# EAGLE design Power Conversion Test Board (EAGLE 9.2.0)
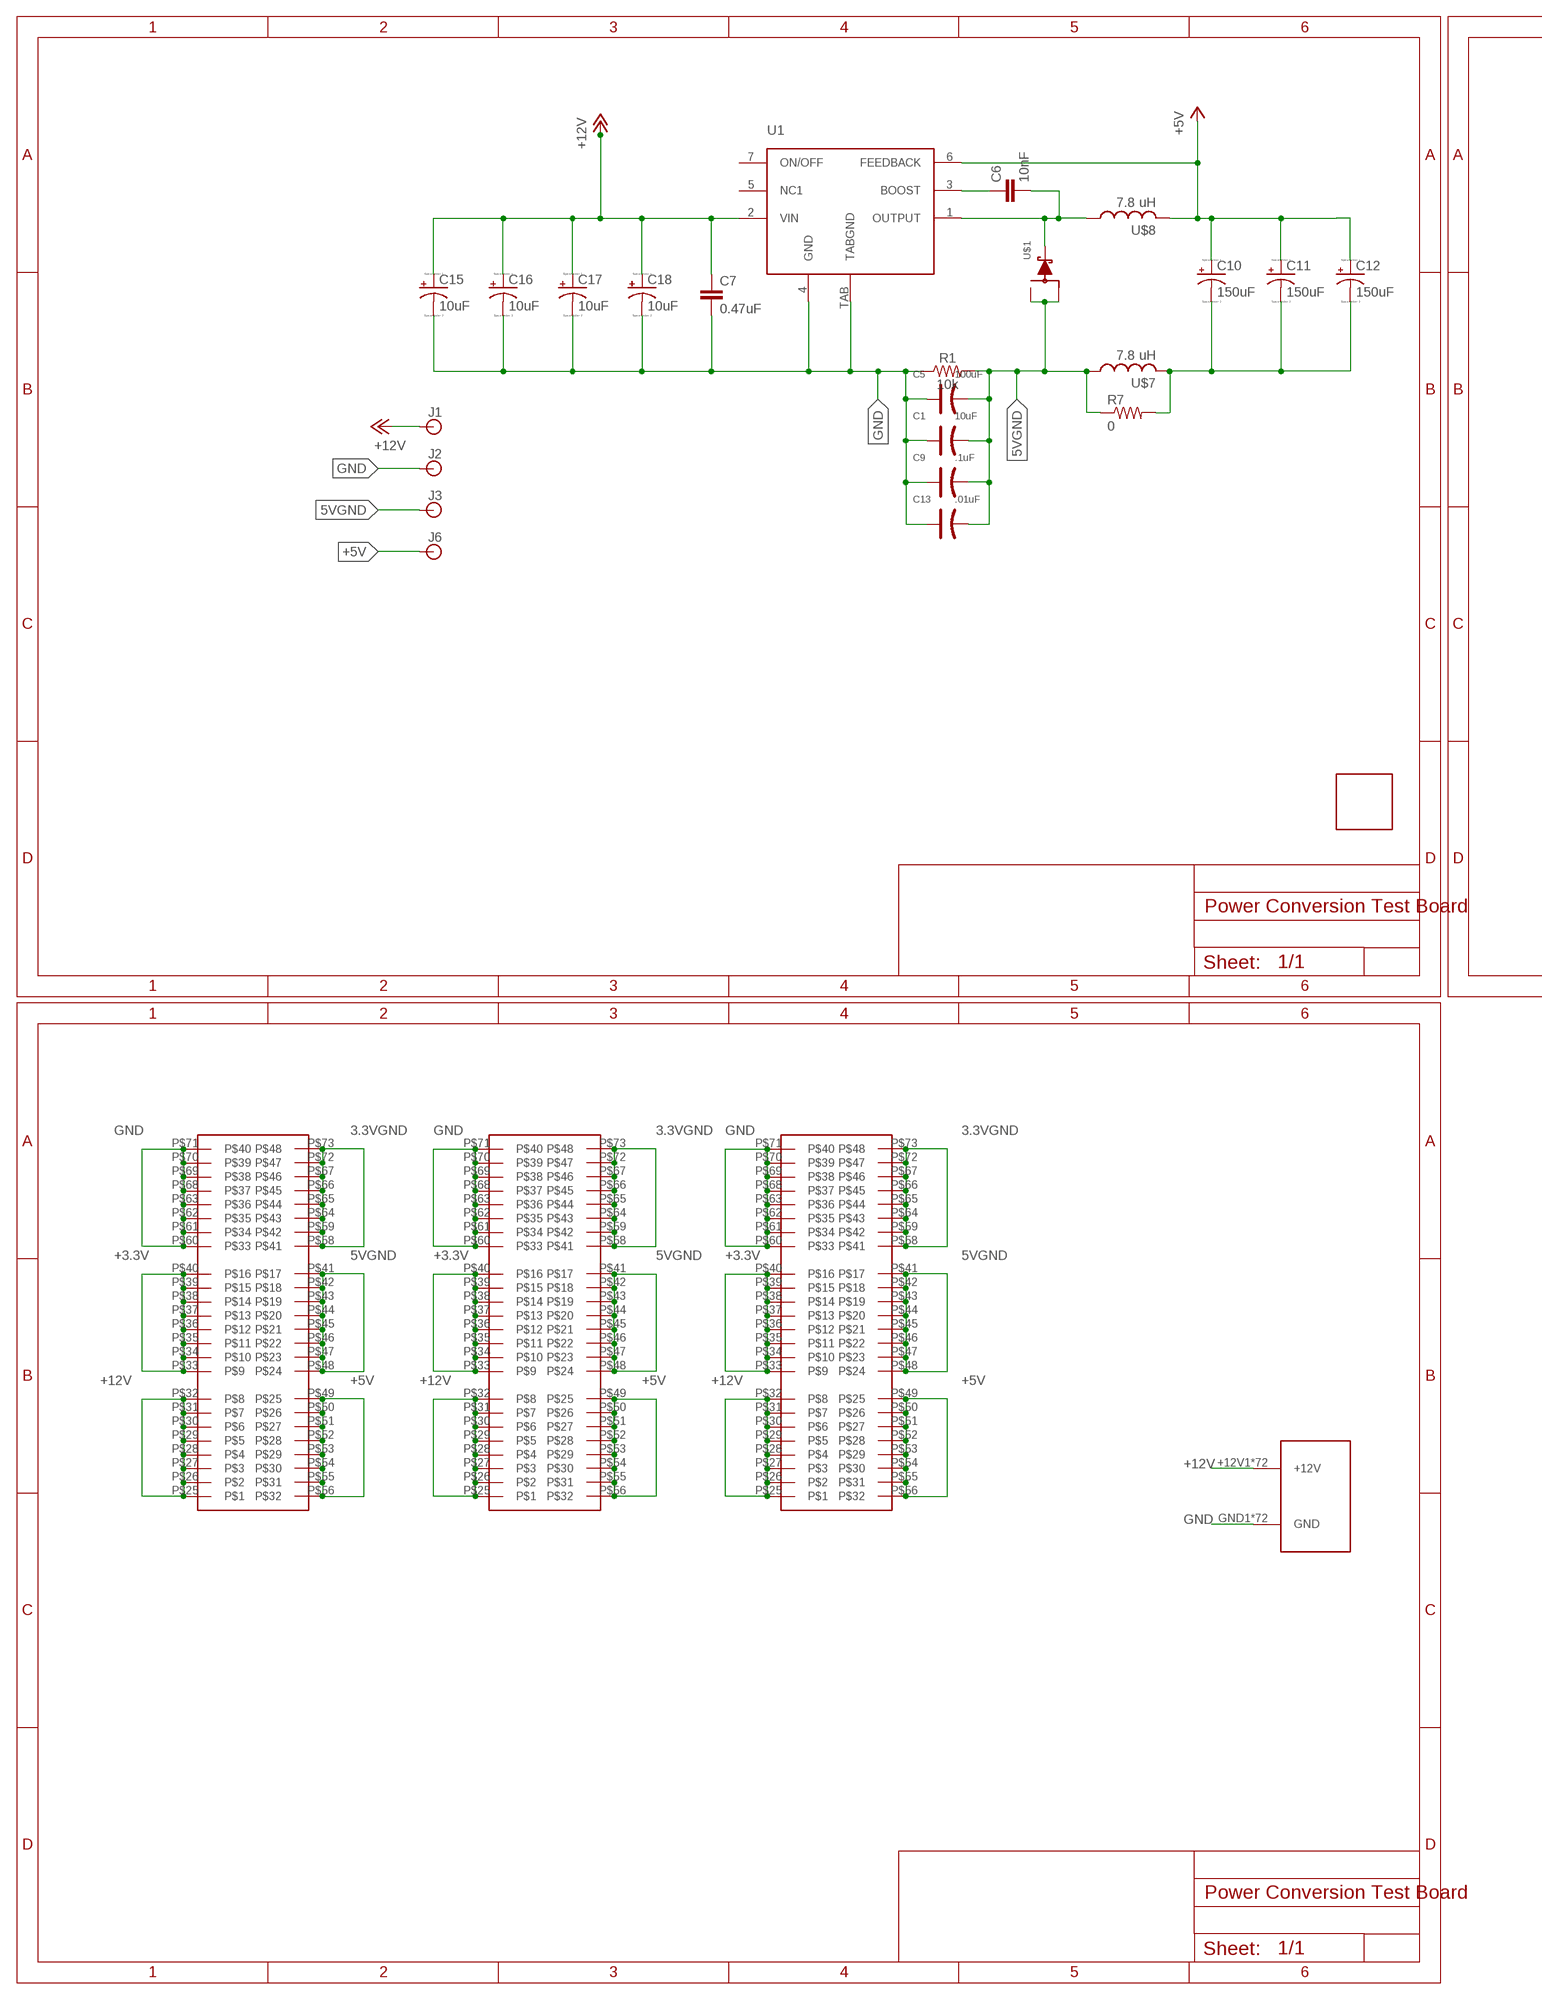
[diagram p0: schematic, sheet 1, part 1 of 2]
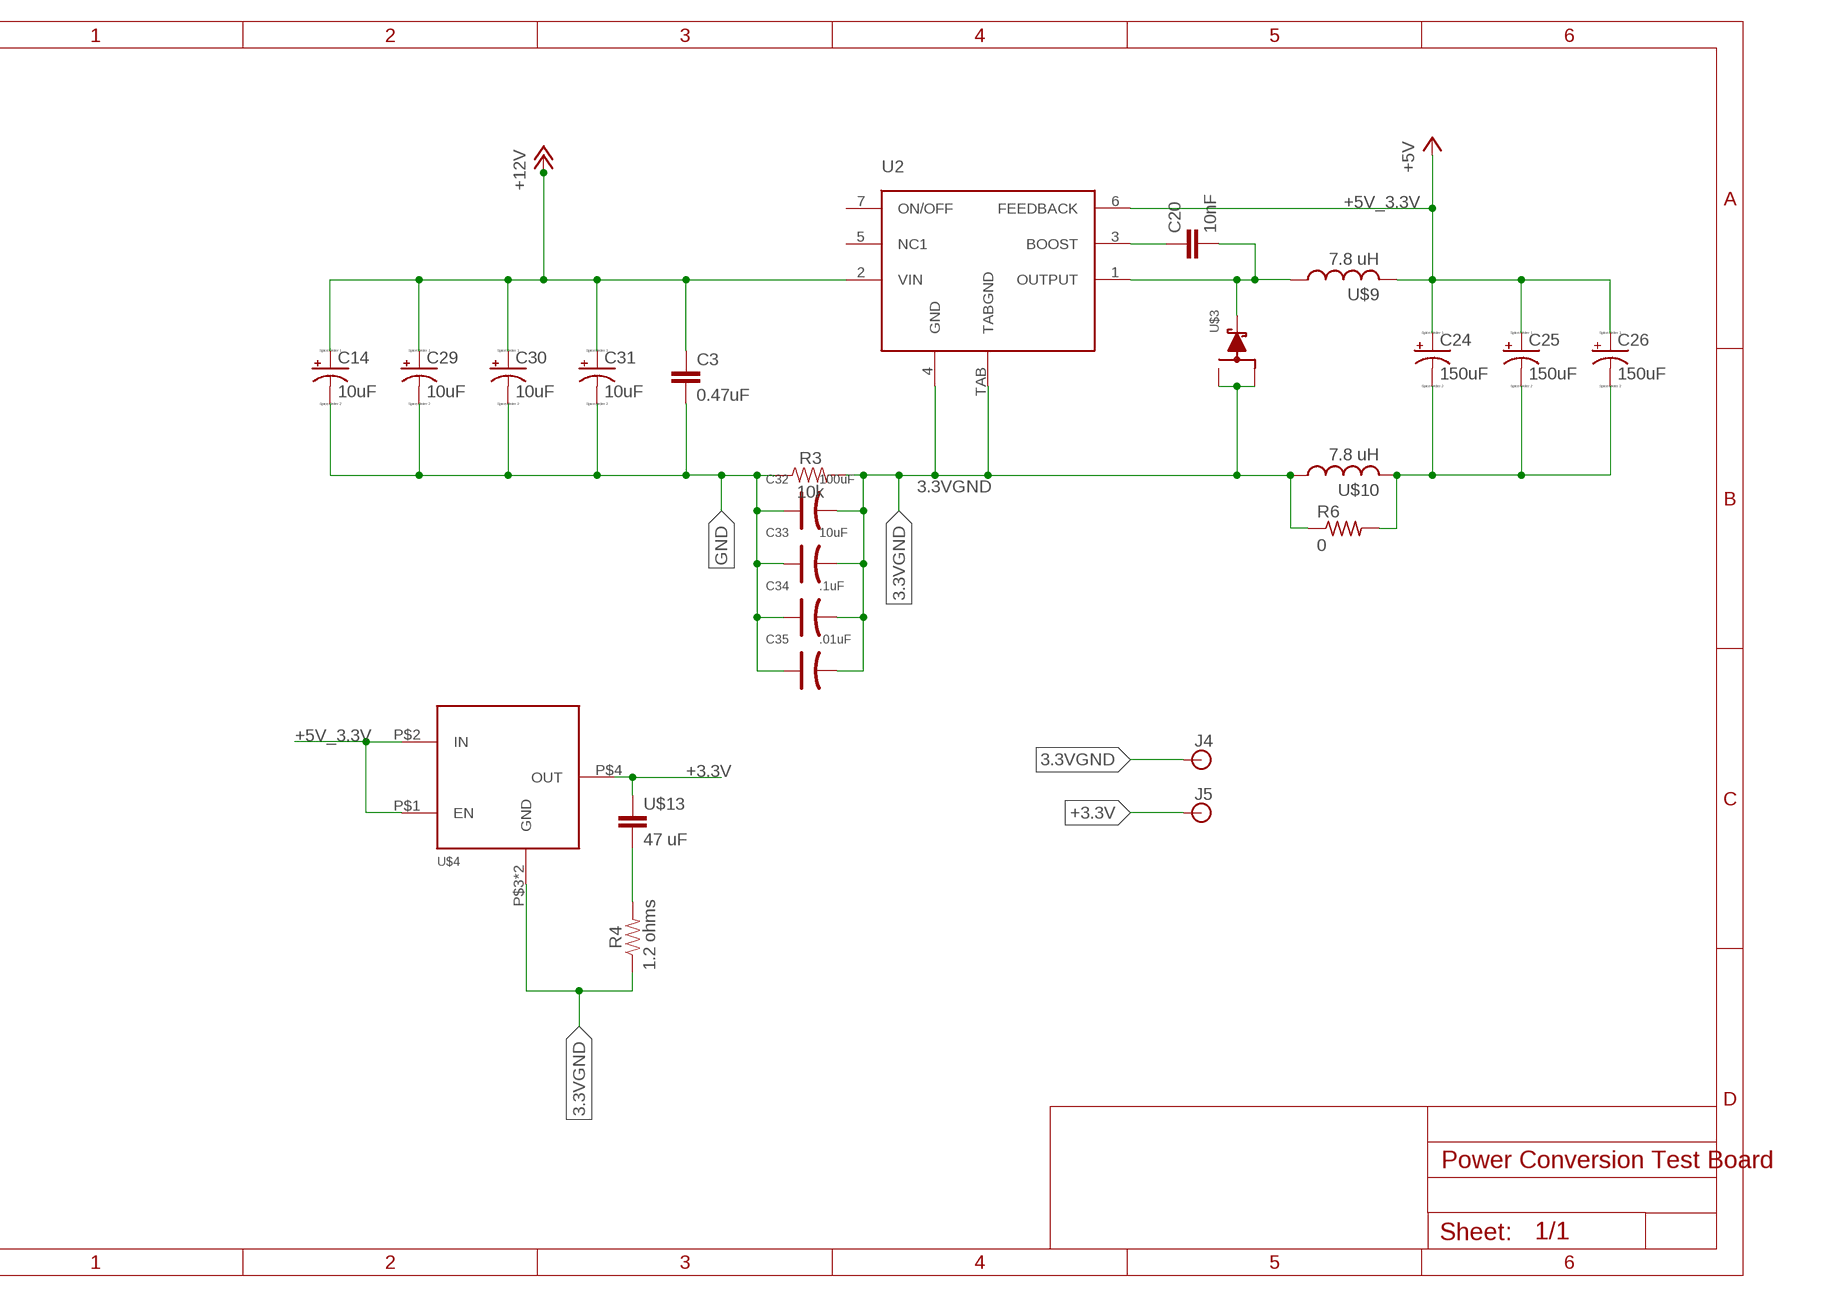
[diagram p1: schematic, sheet 1, part 2 of 2]

## Parts
C1  10uF  TANTALUM-SMD-10UF-16V-10%(AVX-A)  [AVX-A]
C3  0.47uF  C-EUC0603  [C0603]
C5  100uF  TANTALUM-SMD-10UF-16V-10%(AVX-A)  [AVX-A]
C6  10nF  10NF-0603-50V-10%  [0603]
C7  0.47uF  C-EUC0603  [C0603]
C9  .1uF  TANTALUM-SMD-10UF-16V-10%(AVX-A)  [AVX-A]
C10  150uF  C-TANTALUM(10UF_150UF)  [CTAN(7.30_4.30MM)]
C11  150uF  C-TANTALUM(10UF_150UF)  [CTAN(7.30_4.30MM)]
C12  150uF  C-TANTALUM(10UF_150UF)  [CTAN(7.30_4.30MM)]
C13  .01uF  TANTALUM-SMD-10UF-16V-10%(AVX-A)  [AVX-A]
C14  10uF  C-TANTALUM(10UF_150UF)  [CTAN(7.30_4.30MM)]
C15  10uF  C-TANTALUM(10UF_150UF)  [CTAN(7.30_4.30MM)]
C16  10uF  C-TANTALUM(10UF_150UF)  [CTAN(7.30_4.30MM)]
C17  10uF  C-TANTALUM(10UF_150UF)  [CTAN(7.30_4.30MM)]
C18  10uF  C-TANTALUM(10UF_150UF)  [CTAN(7.30_4.30MM)]
C20  10nF  10NF-0603-50V-10%  [0603]
C24  150uF  C-TANTALUM(10UF_150UF)  [CTAN(7.30_4.30MM)]
C25  150uF  C-TANTALUM(10UF_150UF)  [CTAN(7.30_4.30MM)]
C26  150uF  C-TANTALUM(10UF_150UF)  [CTAN(7.30_4.30MM)]
C29  10uF  C-TANTALUM(10UF_150UF)  [CTAN(7.30_4.30MM)]
C30  10uF  C-TANTALUM(10UF_150UF)  [CTAN(7.30_4.30MM)]
C31  10uF  C-TANTALUM(10UF_150UF)  [CTAN(7.30_4.30MM)]
C32  100uF  TANTALUM-SMD-10UF-16V-10%(AVX-A)  [AVX-A]
C33  10uF  TANTALUM-SMD-10UF-16V-10%(AVX-A)  [AVX-A]
C34  .1uF  TANTALUM-SMD-10UF-16V-10%(AVX-A)  [AVX-A]
C35  .01uF  TANTALUM-SMD-10UF-16V-10%(AVX-A)  [AVX-A]
J1  BANANA_CONN  [BANANA_CONN]
J2  BANANA_CONN  [BANANA_CONN]
J3  BANANA_CONN  [BANANA_CONN]
J4  BANANA_CONN  [BANANA_CONN]
J5  BANANA_CONN  [BANANA_CONN]
J6  BANANA_CONN  [BANANA_CONN]
R1  10k  10KOHM-0603-1/10W-1%  [0603]
R3  10k  10KOHM-0603-1/10W-1%  [0603]
R4  1.2 ohms  RESISTOR0603  [0603]
R6  0  R-US_R1206  [R1206]
R7  0  R-US_R1206  [R1206]
U1  LM2678  [LM2678]
U2  LM2678  [LM2678]
U$1  SWITCHMODE_SCHOTTKY  [DPAK-3]
U$2  PDB_PCB_CONNEC  [PDB_PCB_2]
U$3  SWITCHMODE_SCHOTTKY  [DPAK-3]
U$4  TO-263  [TO-263]
U$5  BOARDPCB  [PCB]
U$6  ET60S  [ET60S]
U$7  7.8 uH  HCMA1305  [HCMA1305]
U$8  7.8 uH  HCMA1305  [HCMA1305]
U$9  7.8 uH  HCMA1305  [HCMA1305]
U$10  7.8 uH  HCMA1305  [HCMA1305]
U$11  ET60S  [ET60S]
U$12  ET60S  [ET60S]
U$13  47 uF  CAPACITOR_0603_N  [RESC0603_N]

## Nets
3.3VGND: C32.- C33.- C34.- C35.- J4.P$1 R3.2 R4.1 R6.1 U2.4(GND) U2.TAB(TABGND) U$3.P$1 U$3.P$3 U$4.P$3(GND) U$4.P$6(GND) U$6.P$58 U$6.P$59 U$6.P$64 U$6.P$65 U$6.P$66 U$6.P$67 U$6.P$72 U$6.P$73 U$10.P$1 U$11.P$58 U$11.P$59 U$11.P$64 U$11.P$65 U$11.P$66 U$11.P$67 U$11.P$72 U$11.P$73 U$12.P$58 U$12.P$59 U$12.P$64 U$12.P$65 U$12.P$66 U$12.P$67 U$12.P$72 U$12.P$73
5VGND: C1.- C5.- C9.- C13.- J3.P$1 R1.2 R7.1 U$1.P$1 U$1.P$3 U$6.P$41 U$6.P$42 U$6.P$43 U$6.P$44 U$6.P$45 U$6.P$46 U$6.P$47 U$6.P$48 U$7.P$1 U$11.P$41 U$11.P$42 U$11.P$43 U$11.P$44 U$11.P$45 U$11.P$46 U$11.P$47 U$11.P$48 U$12.P$41 U$12.P$42 U$12.P$43 U$12.P$44 U$12.P$45 U$12.P$46 U$12.P$47 U$12.P$48
+3.3V: J5.P$1 U$4.P$4(OUT) U$6.P$33 U$6.P$34 U$6.P$35 U$6.P$36 U$6.P$37 U$6.P$38 U$6.P$39 U$6.P$40 U$11.P$33 U$11.P$34 U$11.P$35 U$11.P$36 U$11.P$37 U$11.P$38 U$11.P$39 U$11.P$40 U$12.P$33 U$12.P$34 U$12.P$35 U$12.P$36 U$12.P$37 U$12.P$38 U$12.P$39 U$12.P$40 U$13.1
+5V: C10.+ C11.+ C12.+ J6.P$1 U1.6(FEEDBACK) U$6.P$49 U$6.P$50 U$6.P$51 U$6.P$52 U$6.P$53 U$6.P$54 U$6.P$55 U$6.P$56 U$8.P$2 U$11.P$49 U$11.P$50 U$11.P$51 U$11.P$52 U$11.P$53 U$11.P$54 U$11.P$55 U$11.P$56 U$12.P$49 U$12.P$50 U$12.P$51 U$12.P$52 U$12.P$53 U$12.P$54 U$12.P$55 U$12.P$56
+5V_3.3V: C24.+ C25.+ C26.+ U2.6(FEEDBACK) U$4.P$1(EN) U$4.P$2(IN) U$9.P$2 ; supply symbol labelled +5V
+12V: C3.1 C7.1 C14.+ C15.+ C16.+ C17.+ C18.+ C29.+ C30.+ C31.+ J1.P$1 U1.2(VIN) U2.2(VIN) U$2.+12V1(+12V) U$2.+12V2(+12V) U$2.+12V3(+12V) U$2.+12V4(+12V) U$2.+12V5(+12V) U$2.+12V6(+12V) U$2.+12V7(+12V) U$2.+12V8(+12V) U$2.+12V9(+12V) U$2.+12V10(+12V) U$2.+12V11(+12V) U$2.+12V12(+12V) U$2.+12V13(+12V) U$2.+12V14(+12V) U$2.+12V15(+12V) U$2.+12V16(+12V) U$2.+12V17(+12V) U$2.+12V18(+12V) U$2.+12V19(+12V) U$2.+12V20(+12V) U$2.+12V21(+12V) U$2.+12V22(+12V) U$2.+12V23(+12V) U$2.+12V24(+12V) U$2.+12V25(+12V) U$2.+12V26(+12V) U$2.+12V27(+12V) U$2.+12V28(+12V) U$2.+12V29(+12V) U$2.+12V30(+12V) U$2.+12V31(+12V) U$2.+12V32(+12V) U$2.+12V33(+12V) U$2.+12V34(+12V) U$2.+12V35(+12V) U$2.+12V36(+12V) U$2.+12V37(+12V) U$2.+12V38(+12V) U$2.+12V39(+12V) U$2.+12V40(+12V) U$2.+12V41(+12V) U$2.+12V42(+12V) U$2.+12V43(+12V) U$2.+12V44(+12V) U$2.+12V45(+12V) U$2.+12V46(+12V) U$2.+12V47(+12V) U$2.+12V48(+12V) U$2.+12V49(+12V) U$2.+12V50(+12V) U$2.+12V51(+12V) U$2.+12V52(+12V) U$2.+12V53(+12V) U$2.+12V54(+12V) U$2.+12V55(+12V) U$2.+12V56(+12V) U$2.+12V57(+12V) U$2.+12V58(+12V) U$2.+12V59(+12V) U$2.+12V60(+12V) U$2.+12V61(+12V) U$2.+12V62(+12V) U$2.+12V63(+12V) U$2.+12V64(+12V) U$2.+12V65(+12V) U$2.+12V66(+12V) U$2.+12V67(+12V) U$2.+12V68(+12V) U$2.+12V69(+12V) U$2.+12V70(+12V) U$2.+12V71(+12V) U$2.+12V72(+12V) U$6.P$25 U$6.P$26 U$6.P$27 U$6.P$28 U$6.P$29 U$6.P$30 U$6.P$31 U$6.P$32 U$11.P$25 U$11.P$26 U$11.P$27 U$11.P$28 U$11.P$29 U$11.P$30 U$11.P$31 U$11.P$32 U$12.P$25 U$12.P$26 U$12.P$27 U$12.P$28 U$12.P$29 U$12.P$30 U$12.P$31 U$12.P$32
GND: C1.+ C3.2 C5.+ C7.2 C9.+ C13.+ C14.- C15.- C16.- C17.- C18.- C29.- C30.- C31.- C32.+ C33.+ C34.+ C35.+ J2.P$1 R1.1 R3.1 U1.4(GND) U1.TAB(TABGND) U$2.GND1(GND) U$2.GND2(GND) U$2.GND3(GND) U$2.GND4(GND) U$2.GND5(GND) U$2.GND6(GND) U$2.GND7(GND) U$2.GND8(GND) U$2.GND9(GND) U$2.GND10(GND) U$2.GND11(GND) U$2.GND12(GND) U$2.GND13(GND) U$2.GND14(GND) U$2.GND15(GND) U$2.GND16(GND) U$2.GND17(GND) U$2.GND18(GND) U$2.GND19(GND) U$2.GND20(GND) U$2.GND21(GND) U$2.GND22(GND) U$2.GND23(GND) U$2.GND24(GND) U$2.GND25(GND) U$2.GND26(GND) U$2.GND27(GND) U$2.GND28(GND) U$2.GND29(GND) U$2.GND30(GND) U$2.GND31(GND) U$2.GND32(GND) U$2.GND33(GND) U$2.GND34(GND) U$2.GND35(GND) U$2.GND36(GND) U$2.GND37(GND) U$2.GND38(GND) U$2.GND39(GND) U$2.GND40(GND) U$2.GND41(GND) U$2.GND42(GND) U$2.GND43(GND) U$2.GND44(GND) U$2.GND45(GND) U$2.GND46(GND) U$2.GND47(GND) U$2.GND48(GND) U$2.GND49(GND) U$2.GND50(GND) U$2.GND51(GND) U$2.GND52(GND) U$2.GND53(GND) U$2.GND54(GND) U$2.GND55(GND) U$2.GND56(GND) U$2.GND57(GND) U$2.GND58(GND) U$2.GND59(GND) U$2.GND60(GND) U$2.GND61(GND) U$2.GND62(GND) U$2.GND63(GND) U$2.GND64(GND) U$2.GND65(GND) U$2.GND66(GND) U$2.GND67(GND) U$2.GND68(GND) U$2.GND69(GND) U$2.GND70(GND) U$2.GND71(GND) U$2.GND72(GND) U$6.P$60 U$6.P$61 U$6.P$62 U$6.P$63 U$6.P$68 U$6.P$69 U$6.P$70 U$6.P$71 U$11.P$60 U$11.P$61 U$11.P$62 U$11.P$63 U$11.P$68 U$11.P$69 U$11.P$70 U$11.P$71 U$12.P$60 U$12.P$61 U$12.P$62 U$12.P$63 U$12.P$68 U$12.P$69 U$12.P$70 U$12.P$71
N$1: C6.2 U1.1(OUTPUT) U$1.P$4 U$8.P$1
N$2: C20.1 U2.3(BOOST)
N$3: C6.1 U1.3(BOOST)
N$4: C24.- C25.- C26.- R6.2 U$10.P$2
N$7: C20.2 U2.1(OUTPUT) U$3.P$4 U$9.P$1
N$8: C10.- C11.- C12.- R7.2 U$7.P$2
N$10: R4.2 U$13.2
Unconnected: U1.5(NC1) U1.7(ON/OFF) U2.5(NC1) U2.7(ON/OFF)

## Library data of the parts
C1 C5 C9 C13 C32-C35 = Seeed-Capacitor:TANTALUM-SMD-10UF-16V-10%(AVX-A): 302020002; MPN: TAJA106K016RNJ; VALUE: 10uf
C3 C7 = rcl:C-EU: CAPACITOR, European symbol
C6 C20 = SparkFun-Capacitors:10NF: 0.01uF/10nF/10,000pF ceramic capacitors A capacitor is a passive two-terminal electrical component used to store electrical energy temporarily in an electric field. CAP-09321; PROD_ID: CAP-00867
C10-C12 C14-C18 C24-C26 C29-C31 = PowerComponents:C-TANTALUM(10UF_150UF)
J1-J6 = SparkFun-Connectors:BANANA_CONN: Through-hole Banana Jack Basic PTH connection for banana jack plugs SparkFun Products: Multimeter Kit <https://www.sparkfun.com/products/retired/10956> Banana to Alligator Cable <https://www.sparkfun.com/products/retired/509> Banana to Alligator Coax Cable <https://www.sparkfun.com/products/retired/508> Banana to Banana Cable <https://www.sparkfun.com/products/retired/507> Banana to IC Hook Cables <https://www.sparkfun.com/products/retired/506>
R1 R3 = SparkFun-Resistors:10KOHM: 10kΩ resistor A resistor is a passive two-terminal electrical component that implements electrical resistance as a circuit element. Resistors act to reduce current flow, and, at the same time, act to lower voltage levels within circuits. - Wikipedia; PROD_ID: RES-00824
R4 = SparkFun-Resistors:RESISTOR: Generic Resistor Package
R6 = audio amplifier example:R-US_: RESISTOR, American symbol
R7 = audio amplifier example:R-US_: RESISTOR, American symbol; SPICEPREFIX: R
U1 U2 = PowerComponents:LM2678: LM2678 Buck Converter IC 12V-to-5V
U$1 U$3 = PowerComponents:SWITCHMODE_SCHOTTKY: {Digi-Key Part Number: MBRD835LT4GOSCT-ND} {Voltage - DC Reverse (Vr) (Max): 35V} {Current - Average Rectified (Io): 8A} {Voltage - Forward (Vf) (Max) @ If: 510mV @ 8A} {Speed: Fast Recovery =< 500ns, > 200mA (Io)} {Current - Reverse Leakage @ Vr: 1.4mA @ 35V} {Mounting Type: Surface Mount} {Package / Case: TO-252-3, DPak (2 Leads + Tab), SC-63} {Supplier Device Package: DPAK-3} {Operating Temperature - Junction: -65°C ~ 150°C}
U$2 = PDB_PCB_connectors:PDB_PCB_CONNEC
U$4 = TPS758:TO-263
U$5 = board_outlines:BOARD
U$6 U$11 U$12 = ET60S:ET60S
U$7-U$10 = DiscreteComponents:HCMA1305
U$13 = Nordic_nRF:CAPACITOR: Generic chip capacitor

## Board
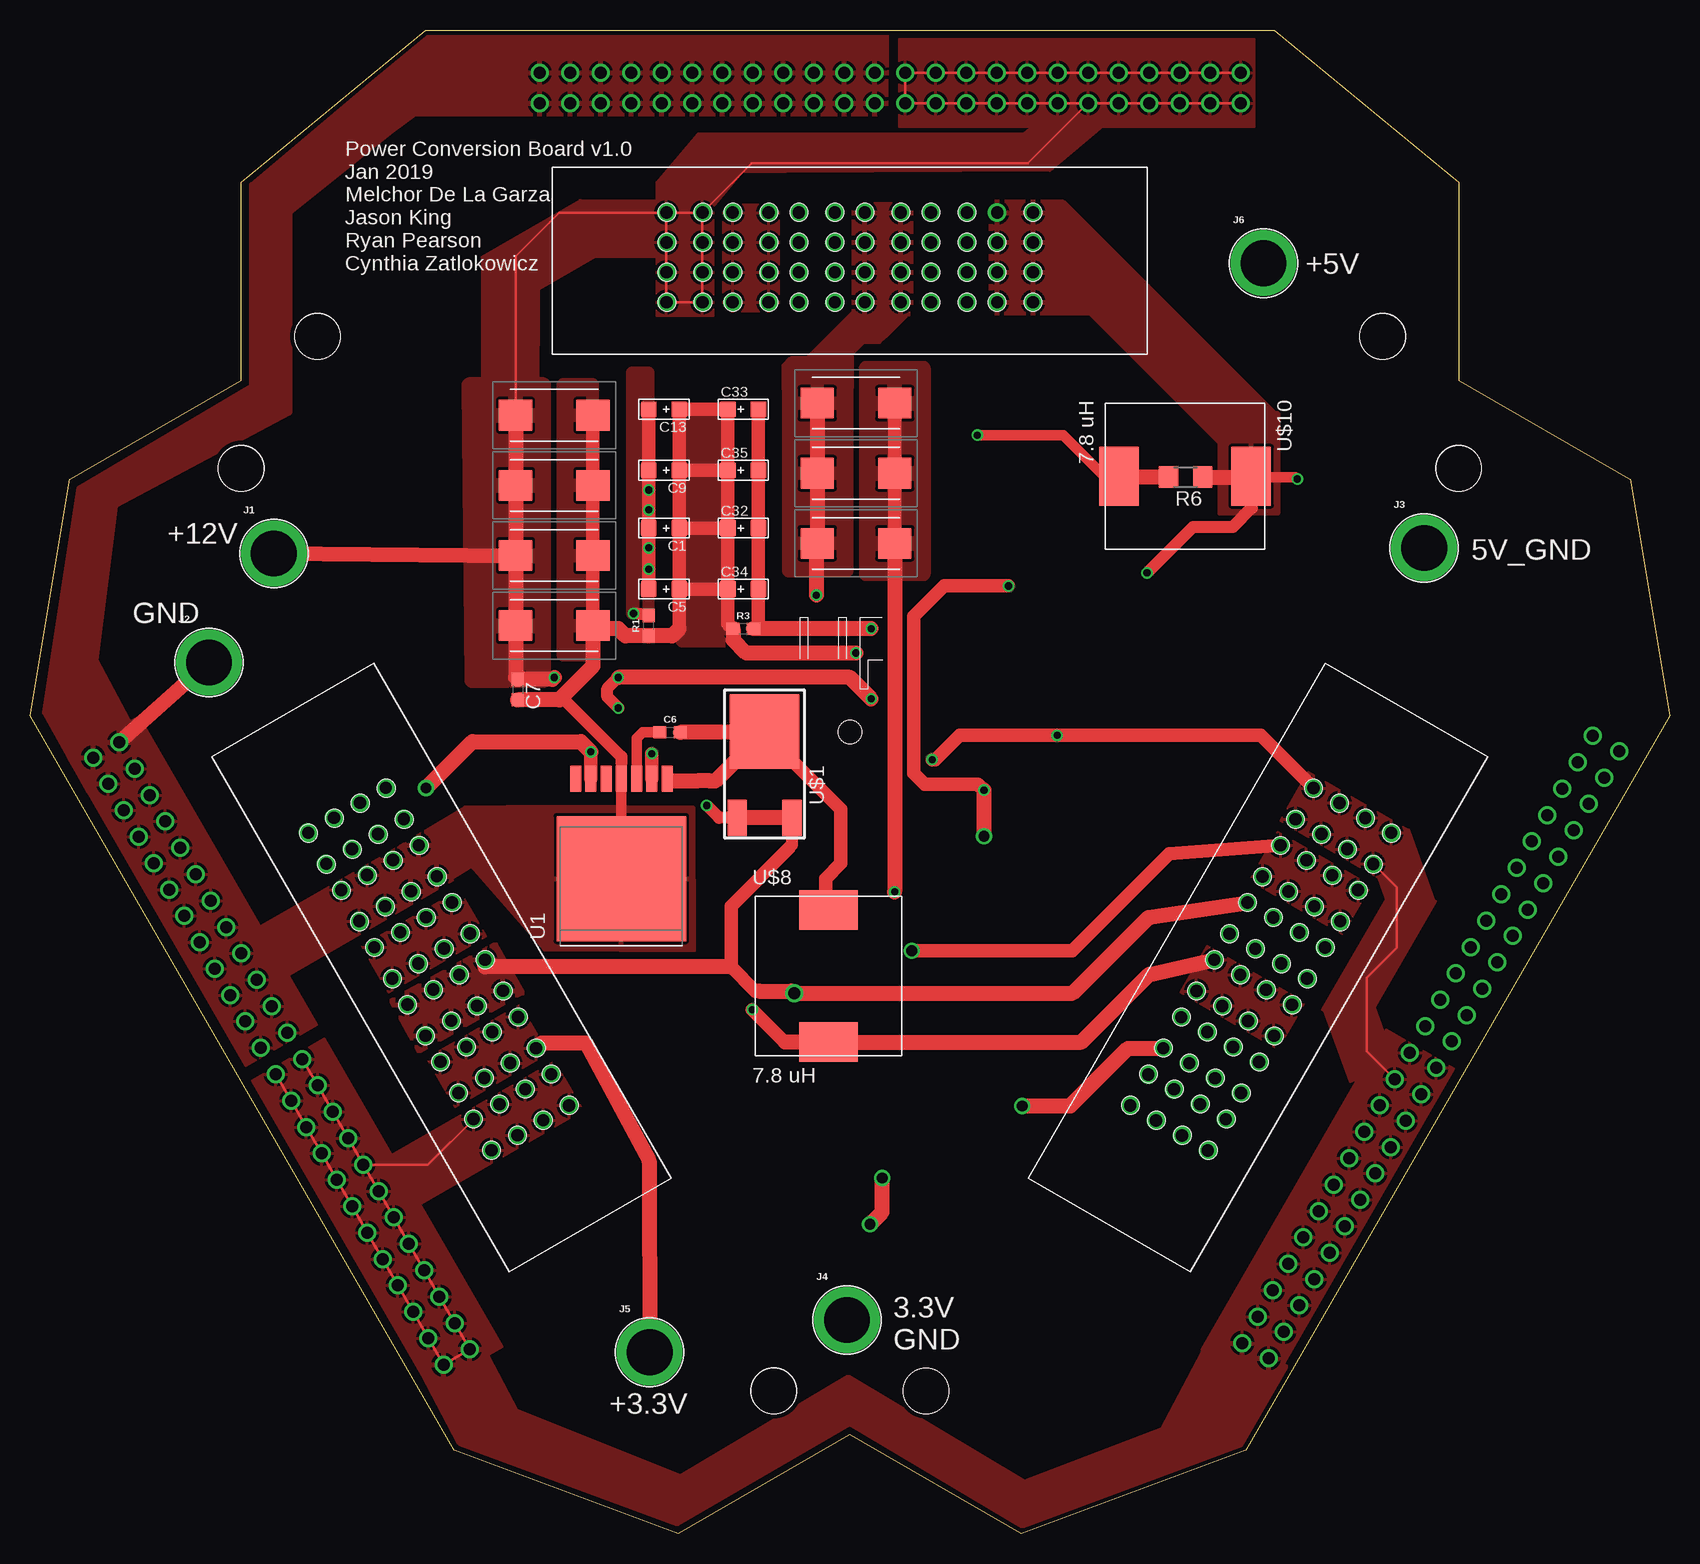
[diagram p2: board, top side]
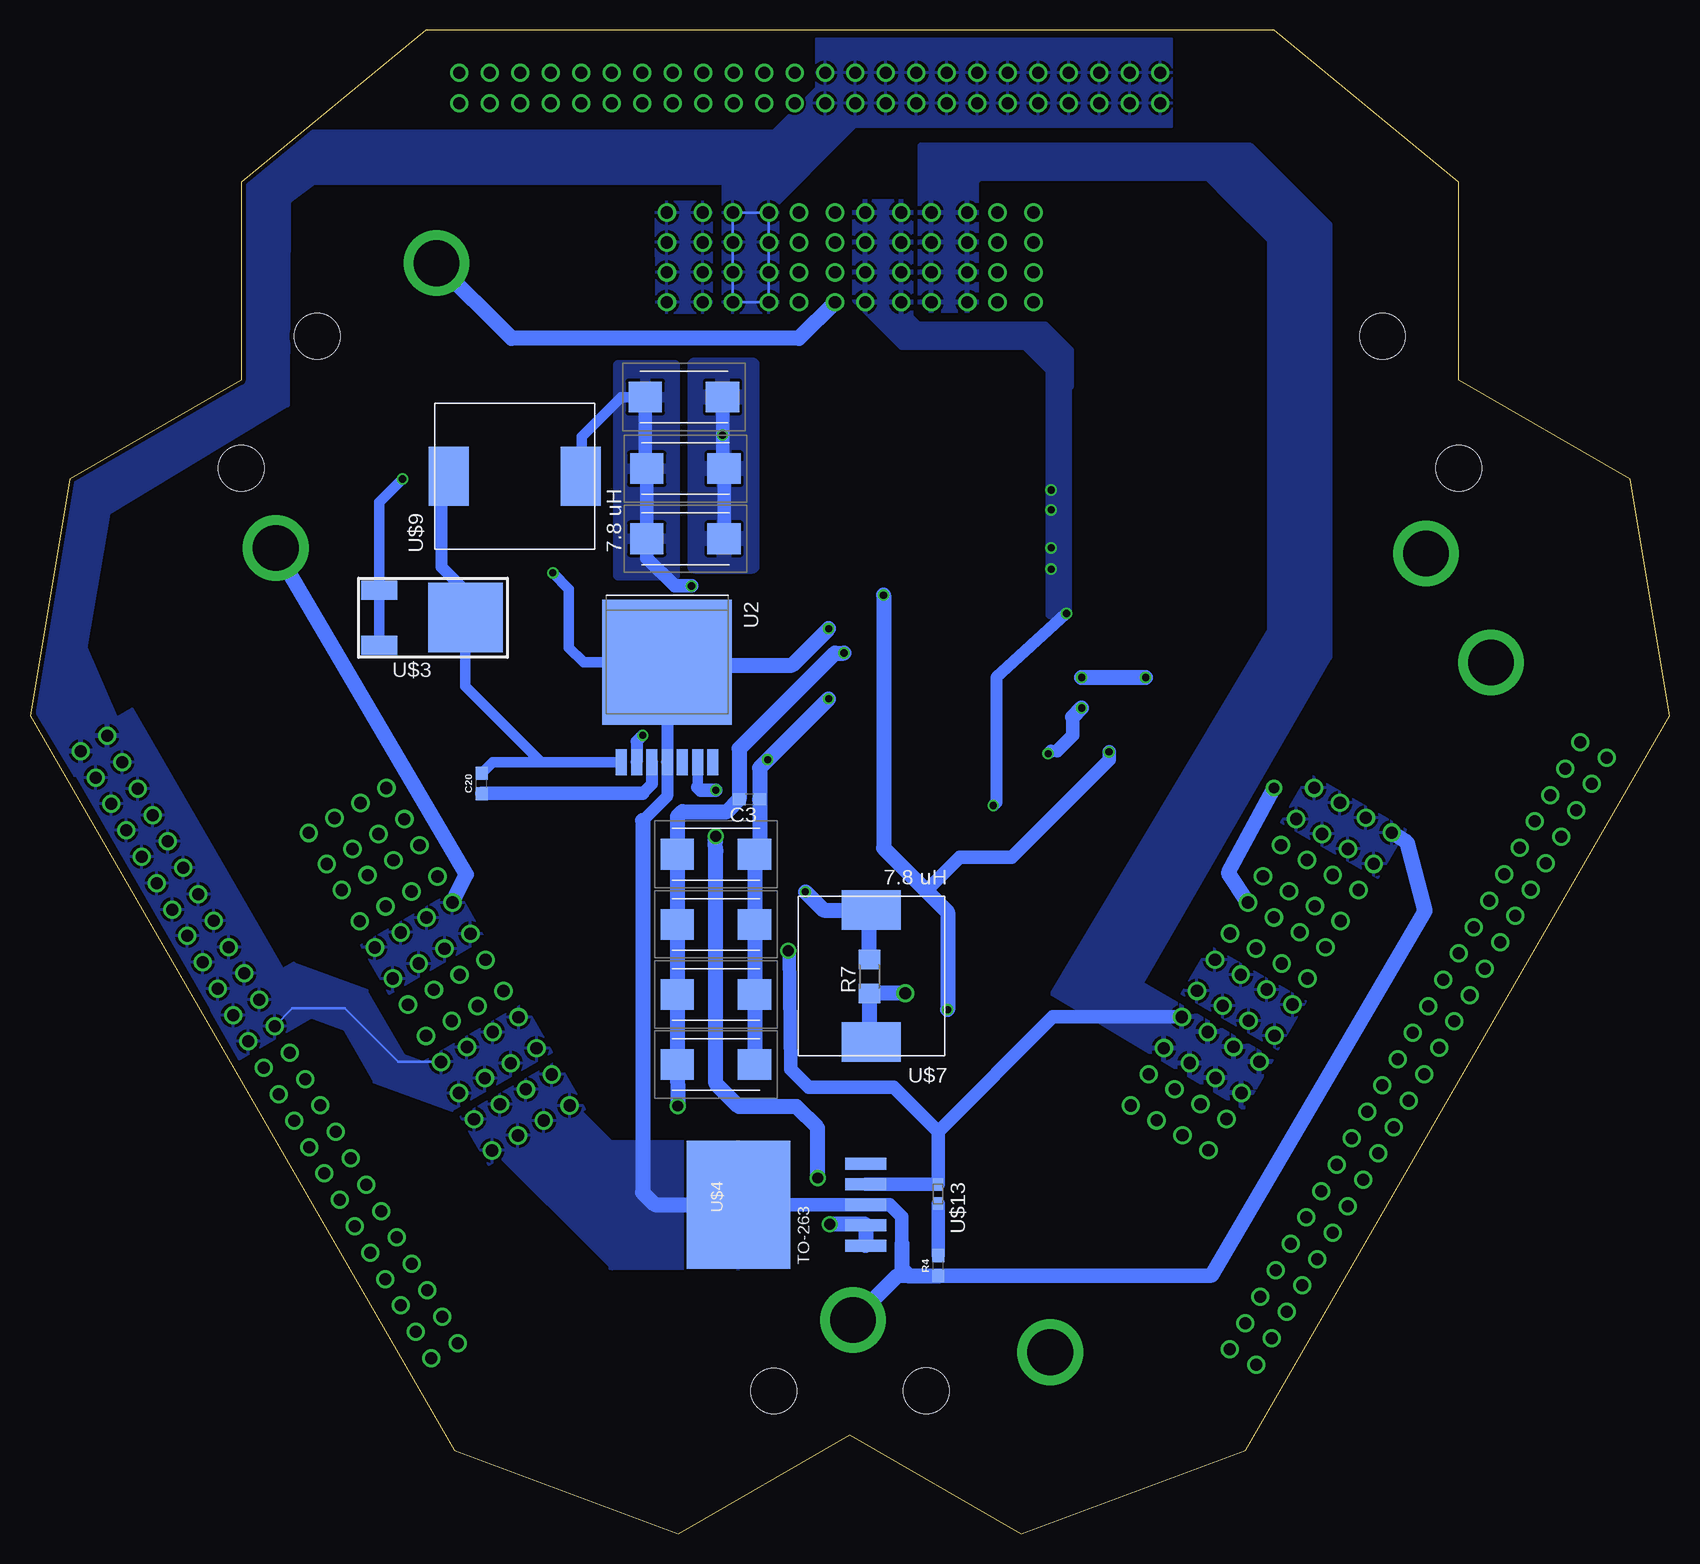
[diagram p3: board, bottom side, seen from below]

Size 136.66 x 125.33 mm. Coordinates in mm from the lower left corner, seen from the top.
Copper layers (1*2+15*16): Top 0.0356mm / dielectric 1.5011mm / Route2 0.0356mm / dielectric 0.1499mm / Route15 0.0356mm / dielectric 0.2007mm / Bottom 0.0356mm
Design rules "ECE_Senior_Design *": minimum track width 8mil, minimum drill 13mil, track to track 8mil, track to pad 8mil, pad to pad 6mil, via to via 8mil, smd to smd 6mil, copper to edge 15mil, drill to drill 8mil, minimum pad ring 7mil, minimum via ring 7mil, stop-mask expansion 3mil, vias tented up to drill 0mil, thermal gap 10mil

### Footprints (pad centres in the part's own frame; a part is rotated, then mirrored left to right if it is on the bottom)
AVX-A = smd 1.27 x 1.27: + -1.27,0; - 1.27,0
C0603 = smd 1.1 x 1: 1 -0.85,0; 2 0.85,0
0603 = smd 1.1 x 1: 1 -0.85,0; 2 0.85,0
CTAN(7.30_4.30MM) = smd 2.77 x 2.55: + -3.22,0; - 3.22,0
BANANA_CONN = drill 3.81 pad 5.461: P$1 0,0
R1206 = smd 1.6 x 1.803: 1 -1.422,0; 2 1.422,0
LM2678 = smd 2.159 x 0.914: 1 8.331,-3.81; 2 8.331,-2.54; 3 8.331,-1.27; 4 8.331,0; 5 8.331,1.27; 6 8.331,2.54; 7 8.331,3.81 | smd 10.414 x 10.795: TAB 0,0
DPAK-3 = smd 3 x 1.6: P$1 4.08,-2.285; P$3 4.08,2.285 | smd 6.2 x 5.8: P$4 -3.1,0
PDB_PCB_2 = drill 1: +12V1 34.462,14.105; +12V2 36.662,15.375; +12V3 33.192,16.305; +12V4 35.392,17.575; +12V5 31.922,18.505; +12V6 34.122,19.775; +12V7 30.652,20.705; +12V8 32.852,21.975; +12V9 29.382,22.904; +12V10 31.582,24.174; +12V11 28.112,25.104; +12V12 30.312,26.374; +12V13 26.842,27.304; +12V14 29.042,28.574; +12V15 25.572,29.503; +12V16 27.772,30.773; +12V17 24.302,31.703; +12V18 26.502,32.973; +12V19 23.032,33.903; +12V20 25.232,35.173; +12V21 21.762,36.103; +12V22 23.962,37.373; +12V23 20.492,38.302; +12V24 22.692,39.572; +12V25 103.23,14.638; +12V26 101.03,15.908; +12V27 104.5,16.838; +12V28 102.3,18.108; +12V29 105.77,19.038; +12V30 103.57,20.308; +12V31 107.04,21.237; +12V32 104.84,22.507; +12V33 108.31,23.437; +12V34 106.11,24.707; +12V35 109.58,25.637; +12V36 107.38,26.907; +12V37 110.85,27.836; +12V38 108.65,29.106; +12V39 112.12,30.036; +12V40 109.92,31.306; +12V41 113.39,32.236; +12V42 111.19,33.506; +12V43 114.66,34.436; +12V44 112.46,35.706; +12V45 115.93,36.635; +12V46 113.73,37.905; +12V47 117.2,38.835; +12V48 115,40.105; +12V49 100.888,119.236; +12V50 100.888,121.776; +12V51 98.348,119.236; +12V52 98.348,121.776; +12V53 95.808,119.236; +12V54 95.808,121.776; +12V55 93.268,119.236; +12V56 93.268,121.776; +12V57 90.728,119.236; +12V58 90.728,121.776; +12V59 88.188,119.236; +12V60 88.188,121.776; +12V61 85.648,119.236; +12V62 85.648,121.776; +12V63 83.108,119.236; +12V64 83.108,121.776; +12V65 80.568,119.236; +12V66 80.568,121.776; +12V67 78.028,119.236; +12V68 78.028,121.776; +12V69 75.488,119.236; +12V70 75.488,121.776; +12V71 72.948,119.236; +12V72 72.948,121.776; GND1 19.222,40.502; GND2 21.422,41.772; GND3 17.952,42.702; GND4 20.152,43.972; GND5 16.682,44.901; GND6 18.882,46.171; GND7 15.412,47.101; GND8 17.612,48.371; GND9 14.142,49.301; GND10 16.342,50.571; GND11 12.872,51.5; GND12 15.072,52.77; GND13 11.602,53.7; GND14 13.802,54.97; GND15 10.332,55.9; GND16 12.532,57.17; GND17 9.062,58.1; GND18 11.262,59.37; GND19 7.792,60.299; GND20 9.992,61.569; GND21 6.522,62.499; GND22 8.722,63.769; GND23 5.252,64.699; GND24 7.452,65.969; GND25 118.47,41.035; GND26 116.27,42.305; GND27 119.74,43.234; GND28 117.54,44.504; GND29 121.01,45.434; GND30 118.81,46.704; GND31 122.28,47.634; GND32 120.08,48.904; GND33 123.55,49.834; GND34 121.35,51.104; GND35 124.82,52.033; GND36 122.62,53.303; GND37 126.09,54.233; GND38 123.89,55.503; GND39 127.36,56.433; GND40 125.16,57.703; GND41 128.63,58.632; GND42 126.43,59.902; GND43 129.9,60.832; GND44 127.7,62.102; GND45 131.17,63.032; GND46 128.97,64.302; GND47 132.44,65.231; GND48 130.24,66.501; GND49 70.408,119.236; GND50 70.408,121.776; GND51 67.868,119.236; GND52 67.868,121.776; GND53 65.328,119.236; GND54 65.328,121.776; GND55 62.788,119.236; GND56 62.788,121.776; GND57 60.248,119.236; GND58 60.248,121.776; GND59 57.708,119.236; GND60 57.708,121.776; GND61 55.168,119.236; GND62 55.168,121.776; GND63 52.628,119.236; GND64 52.628,121.776; GND65 50.088,119.236; GND66 50.088,121.776; GND67 47.548,119.236; GND68 47.548,121.776; GND69 45.008,119.236; GND70 45.008,121.776; GND71 42.468,119.236; GND72 42.468,121.776
TO-263 = smd 1 x 3.4: P$1 -3.4,-10.7; P$2 -1.7,-10.7; P$3 0,-10.7; P$4 1.7,-10.7; P$5 3.4,-10.7 | smd 10.7 x 8.6: P$6 0,-0.1
PCB = hole 3.797: 23.952,99.797; 17.602,88.798; 112.725,99.797; 119.05,88.798; 74.676,11.913; 61.976,11.938
ET60S = drill 1.021: P$25 -15.138,-3.454; P$26 -15.138,-0.965; P$27 -15.138,1.524; P$28 -15.138,4.013; P$29 -12.141,4.013; P$30 -12.141,1.524; P$31 -12.141,-0.965; P$32 -12.141,-3.454; P$33 -9.627,-3.454; P$34 -9.627,-0.965; P$35 -9.627,1.524; P$36 -9.627,4.013; P$37 -6.629,4.013; P$38 -6.629,1.524; P$39 -6.629,-0.965; P$40 -6.629,-3.454; P$41 -4.115,-3.454; P$42 -4.115,-0.965; P$43 -4.115,1.524; P$44 -4.115,4.013; P$45 -1.118,4.013; P$46 -1.118,1.524; P$47 -1.118,-0.965; P$48 -1.118,-3.454; P$49 1.397,-3.454; P$50 1.397,-0.965; P$51 1.397,1.524; P$52 1.397,4.013; P$53 4.394,4.013; P$54 4.394,1.524; P$55 4.394,-0.965; P$56 4.394,-3.454; P$58 15.418,-3.454; P$59 12.421,-3.454; P$60 9.906,-3.454; P$61 6.909,-3.454; P$62 6.909,-0.965; P$63 9.906,-0.965; P$64 12.421,-0.965; P$65 15.418,-0.965; P$66 15.418,1.524; P$67 12.421,1.524; P$68 9.906,1.524; P$69 6.909,1.524; P$70 6.909,4.013; P$71 9.906,4.013; P$72 12.421,4.013; P$73 15.418,4.013
HCMA1305 = smd 4.9 x 3.3: P$1 0,5.5; P$2 0,-5.5
RESC0603_N = smd 1.05 x 0.9: 1 -0.8,0; 2 0.8,0

### Placement (x,y rotation side)
C1  52.83,83.82 180 top
C3  76.71,61.21 180 bottom
C5  52.83,78.74 180 top
C6  53.34,66.8 0 top
C7  40.64,70.36 270 top
C9  52.83,88.65 180 top
C10  68.83,94.23 0 top
C11  68.83,88.39 0 top
C12  68.83,82.55 0 top
C13  52.83,93.73 180 top
C14  79.5,39.12 180 bottom
C15  43.69,93.22 0 top
C16  43.69,87.38 0 top
C17  43.69,81.53 0 top
C18  43.69,75.69 0 top
C20  99.03,62.53 90 bottom
C24  82.17,94.74 0 bottom
C25  82.04,88.77 0 bottom
C26  82.04,82.93 0 bottom
C29  79.5,44.96 180 bottom
C30  79.5,50.8 180 bottom
C31  79.5,56.64 180 bottom
C32  59.44,83.82 0 top
C33  59.44,93.73 0 top
C34  59.44,78.74 0 top
C35  59.44,88.65 0 top
J1  20.32,81.71 0 top
J2  14.91,72.62 0 top
J3  116.18,82.17 0 top
J4  68.07,17.83 0 top
J5  51.64,15.14 0 top
J6  102.79,105.89 0 top
R1  51.56,75.69 90 top
R3  59.44,75.44 0 top
R4  60.96,22.35 90 bottom
R6  96.3,88.07 180 top
R7  66.71,46.45 90 bottom
U1  49.28,54.61 90 top
U2  83.57,72.64 270 bottom
U$1  61.21,63.75 270 top
U$2  0,0 0 top
U$3  103.48,76.35 180 bottom
U$4  77.72,27.43 90 bottom
U$5  0,0 0 top
U$6  34.37,47.09 120 top
U$7  66.55,46.48 180 bottom
U$8  66.55,46.48 0 top
U$9  96.27,88.14 90 bottom
U$10  96.27,88.14 270 top
U$11  102.39,47.32 240 top
U$12  68.17,106.1 0 top
U$13  60.99,28.32 270 bottom

### Tracks (layer width: path | path; a pad name or v marks a point on that pad's centre or on a via)
3.3VGND  (via drill 0.6)
  Top 0.889: U$10.P$1 101.85,88.05 101.83,88.03 | v105.61,87.91 105.45,88.07 101.7,88.07
  Top 1.016: v93.09,80.09 96.93,83.92 100.25,83.92 101.83,85.5 101.83,88.03
  Top 1.143: C33.- C35.- C32.- C34.- 60.71,75.86 R3.2
  Top 1.27: v70.1,75.44 R3.2 | R6.1 101.7,88.07 U$10.P$1
  Bottom 0.889: U$3.P$3 U$3.P$1 107.56,85.96 v105.61,87.91 | U2.TAB 90.53,72.64 91.75,73.86 91.75,78.74 v93.09,80.09
  Bottom 1.016: 83.31,72.39 83.57,72.14 U2.4 83.57,61.47 85.6,59.44
  Bottom 1.143: U$4.P$6 U$4.P$3 65.02,27.43 64.01,26.42 64.01,24.18
  Bottom 1.27: 64.01,24.18 64.01,22.1 63.41,21.5 | 63.41,21.5 R4.1 38.18,21.57 20.4,51.92 21.89,57.63 U$6.P$73 | v70.1,75.44 73.15,72.39 83.31,72.39 U2.TAB | U$4.P$6 84.58,27.43 85.6,28.45 85.6,59.44 | 63.41,21.5 64.4,21.5 J4.P$1
  pour Bottom: 79.86,111 79.86,101.73 84.48,101.75 84.5,111
  pour Bottom: 24.35,54.66 32.38,59.3 30.05,63.29 22.03,58.69
  pour Bottom: 100.76,34.77 92.74,39.4 90.45,35.38 98.44,30.74
  pour Top: 80.11,101.73 80.11,111 86.06,111 103.68,93.37 103.96,93.37 103.96,85.04 99.19,85.04 99.19,90.93 88.39,101.73
  pour Bottom: 73.18,32.74 73.18,22.02 88.35,22.11 88.37,32.74
  pour Bottom: 93.53,38.07 82.79,27.34 88.14,22.05 98.86,32.73
5VGND  (via drill 0.6, 1)
  Top 1.016: U$1.P$3 63.5,57.4 63.25,57.15 | v56.39,60.71 57.42,59.67 U$1.P$1 | R1.2 v50.29,76.71
  Top 1.143: C13.- C9.- v51.56,87 v51.56,85.34 C1.- v51.56,82.17 v51.56,80.39 C5.- | 63.25,57.15 58.42,52.32 58.42,47.24 60.43,45.24 60.73,45.24
  Top 1.27: U$1.P$3 U$1.P$1 | 58.42,47.24 37.92,47.24 U$6.P$48 | 60.73,45.24 63.45,45.24 63.6,45.09 63.68,45.09 v63.7,45.06 86.89,45.06 93.22,51.38 U$11.P$41
  Bottom 1.016: v56.39,60.71 56.13,60.96 56.13,71.37 v50.29,76.71
  Bottom 1.27: U$7.P$1 66.71,41.14 R7.1 66.68,45.06 v63.7,45.06 | J3.P$1 116.18,82.03 100.31,54.97 U$11.P$41
  pour Top: 51.56,76.71 51.56,96.77 50.16,96.77 50.16,76.71
  pour Bottom: 50.29,76.71 50.29,96.77 51.56,96.77 51.56,76.71
  pour Bottom: 63.27,111.02 63.27,101.8 67.9,101.83 67.92,111.02
  pour Bottom: 32.69,40.38 40.67,44.99 38.34,48.99 30.37,44.41
  pour Bottom: 109.06,49.05 101.08,53.66 98.79,49.64 106.74,45.03
  pour Bottom: 63.27,111.07 63.27,101.47 62.64,100.84 52.04,100.84 49.89,98.68 49.89,95.61 50.01,95.48 50.39,95.48 53.77,98.86 64.03,98.86 67.94,102.77 67.94,111.07
  pour Top: 38.79,49.15 41.07,45.09 32.44,40.18 30.1,44.42
+3.3V  (via drill 0.9)
  Top 1.143: v73.48,48.59 86.84,48.59 94.92,56.67 U$11.P$33
  Top 1.27: U$6.P$33 42.61,40.92 46.3,40.92 51.59,31.09 J5.P$1
  Bottom 1.143: v73.48,48.59 73.38,48.59 73.28,38.73 71.76,37.21 64.67,37.21 60.98,33.53 | 60.98,33.53 U$13.1 | 60.98,32.64 U$13.1 | U$4.P$4 61,29.13 U$13.1 | U$6.P$40 51.44,43.08 60.98,33.53
  pour Top: 57.76,110.77 57.76,101.85 62.39,101.88 62.41,110.77
  pour Top: 35.43,35.6 43.15,40.06 40.81,44.06 33.11,39.63
  pour Top: 111.69,54.03 103.97,58.49 101.68,54.47 109.36,50.01
  pour Bottom: 57.78,101.93 62.46,101.93 62.46,115.75 34.98,115.75 28.35,109.12 28.35,73.08 28.4,73.03 44.04,45.9 33.2,39.57 35.56,35.51 51.49,45.03 33.35,75.34 33.35,107.75 36.63,111.02 38.53,112.93 57.56,112.93 57.78,112.7
+5V  (via drill 0.6, 0.9)
  Top 1.143: 62.9,40.98 v60.2,43.69 | v46.74,65.18 U1.6
  Top 1.27: C10.+ C11.+ C12.+ 65.53,82.47 v65.53,78.23 | 62.9,40.98 U$8.P$2 87.62,40.98 93.24,46.61 U$11.P$49 | v32.99,62.15 36.85,66.02 45.9,66.02 v46.74,65.18
  Bottom 1.143: 61.98,53.59 59.18,56.39 54.86,56.39 46.74,64.52 v46.74,65.18
  Bottom 1.27: v60.2,43.69 60.2,51.82 61.98,53.59 65.53,57.15 v65.53,78.23 | U$12.P$49 72.59,99.62 96.52,99.62 J6.P$1 | U$6.P$56 36.8,55.09 32.99,62.08 v32.99,62.15
  pour Top: 63.25,80.26 63.25,97.03 68.07,97.03 68.07,80.26
  pour Top: 68.86,110.87 68.86,101.52 73.26,101.55 73.28,110.87
  pour Top: 29.88,45.13 37.97,49.8 35.75,53.6 27.67,48.96
  pour Top: 106.18,44.28 98.08,48.95 95.9,45.13 103.97,40.45
  pour Top: 73.38,110.74 73.38,101.98 71.22,99.82 70.74,99.34 69.39,99.34 68.43,98.37 68.43,95.45 68.38,95.4 62.84,95.4 62.84,97.36 63.45,97.97 64.87,97.97 68.71,101.8 68.71,110.03 68.71,110.74
+5V_3.3V  (via drill 0.6, 0.9)
  Top 1.143: v81.53,78.99 76.2,78.99 73.66,76.45 73.66,63.4 74.57,62.48 78.99,62.48 v79.5,61.98
  Top 1.27: v70,25.81 71.02,26.82 v71.02,29.67 | v79.5,58.14 v79.5,61.98
  Bottom 0.889: C24.+ 87.38,94.74 90.68,91.44 90.68,88.23 U$9.P$2 | U2.6 81.03,62.23
  Bottom 1.143: C24.+ 85.39,88.9 C25.+ C26.+ 85.26,81.33 82.93,78.99 v81.53,78.99 | 81.03,62.23 80.77,61.98 v79.5,61.98
  Bottom 1.27: U$4.P$1 U$4.P$2 67.1,25.81 v70,25.81 | v71.02,29.67 71.02,33.83 72.8,35.61 77.6,35.61 79.5,37.52 79.5,56.9 79.55,57.68 v79.5,58.14
  pour Bottom: 87.63,97.41 82.93,97.41 82.93,79.88 87.63,79.88
+12V  (via drill 0.6)
  Top 0.203: U$12.P$28 U$12.P$27 U$12.P$26 U$12.P$25 U$12.P$32 U$12.P$31 U$12.P$30 U$12.P$29 | U$12.P$28 U$12.P$29 | U$2.+12V50 U$2.+12V52 U$2.+12V54 U$2.+12V56 U$2.+12V58 U$2.+12V60 U$2.+12V62 U$2.+12V64 U$2.+12V66 U$2.+12V68 U$2.+12V70 U$2.+12V72 U$2.+12V71 | U$2.+12V71 | U$2.+12V71 U$2.+12V69 U$2.+12V67 | U$2.+12V67 | U$2.+12V67 U$2.+12V65 | U$2.+12V65 | U$2.+12V65 U$2.+12V63 U$2.+12V61 | U$2.+12V61 | U$2.+12V61 88.16,119.24 | 88.16,119.24 U$2.+12V59 | U$2.+12V59 | U$2.+12V59 U$2.+12V57 | U$2.+12V57 | U$2.+12V57 | U$2.+12V57 U$2.+12V55 U$2.+12V53 | U$2.+12V53 | U$2.+12V53 U$2.+12V51 | U$2.+12V51 | U$2.+12V51 U$2.+12V49 | U$2.+12V49 | U$2.+12V23 U$2.+12V21 U$2.+12V19 U$2.+12V17 U$2.+12V15 U$2.+12V13 U$2.+12V11 U$2.+12V7 U$2.+12V5 U$2.+12V3 U$2.+12V1 U$2.+12V2 U$2.+12V4 U$2.+12V6 U$2.+12V8 U$2.+12V10 U$2.+12V12 U$2.+12V14 U$2.+12V16 | U$2.+12V16 U$2.+12V18 U$2.+12V20 U$2.+12V22 U$2.+12V24 | U$12.P$29 60.15,114.22 83.15,114.22 88.16,119.24 | U$2.+12V16 33.16,30.77 U$6.P$29 | U$11.P$29 113.89,53.87 113.89,48.84 111.4,46.35 111.4,40.23 U$2.+12V46 | C15.+ 40.47,106.46 44.12,110.11 U$12.P$28
  Top 1.016: v49.02,68.83 48.11,69.75 48.11,70.46 v49.02,71.37
  Top 1.143: v75.18,64.52 75.44,64.52 77.47,66.55 v85.6,66.55 102.58,66.55 U$11.P$25 | v51.82,65.02 U1.2
  Top 1.27: C17.+ C18.+ 40.47,71.38 C7.1 43.52,71.21 v43.69,71.37 | C15.+ C16.+ C17.+ | v49.02,71.37 68.33,71.37 v70.1,69.6 | J1.P$1 C17.+
  Bottom 1.016: U2.2 86.11,66.04 v85.6,66.55 | 51.05,65.28 51.56,65.28 v51.82,65.02
  Bottom 1.143: 49.78,68.07 49.78,66.55 51.05,65.28
  Bottom 1.27: C14.+ C29.+ C30.+ C31.+ 75.86,57.07 C3.1 75.86,63.84 v75.18,64.52 v70.1,69.6 | v49.02,71.37 v43.69,71.37 | 49.78,68.07 v49.02,68.83
  pour Top: 42.8,71.12 42.8,95.76 36.57,95.76 36.83,71.12
  pour Top: 72.44,117.27 102.03,117.27 102.03,124.54 72.44,124.54
  pour Top: 39.33,15.6 24.53,41.25 18.52,37.78 33.33,12.13
  pour Top: 113.04,42.02 97.64,15.35 103.26,12.11 118.66,38.78
  pour Top: 52.25,112.62 52.25,101.5 56.92,101.52 56.95,112.62
  pour Top: 55.97,109.45 59.42,113.56 55.67,116.66 52.24,112.59
  pour Top: 55.67,116.69 55.67,113.46 84.97,113.62 84.98,116.69
  pour Top (isolate 0.305): 84.96,113.59 93.1,120.42 90.69,123.26 82.56,116.46
  pour Top: 27.14,24.38 46.06,35.3 43.7,39.34 24.78,28.47
  pour Top: 114.86,58.66 106.52,63.47 104.21,59.43 112.53,54.61
  pour Top: 111.41,57.4 113.62,51.32 117.08,52.61 114.89,58.67
  pour Top: 110.87,41.83 117.15,52.71 113.97,54.52 107.68,43.68
  pour Top: 107.83,43.73 110.04,37.66 113.79,39.05 111.6,45.11
  pour Top: 45.82,106.43 56.95,106.43 56.92,111.1 45.82,111.12
  pour Top: 40.01,102.33 48.24,107.08 45.88,111.12 37.66,106.4
  pour Top: 37.69,106.35 37.69,91.56 42.36,91.59 42.39,106.35
  pour Top: 32.79,13.28 35.79,7.57 53.95,0.84 68.33,9.17 82.9,0.52 101.42,7.42 105.11,13.69 98.89,17.27 94.36,8.7 82.9,4.33 68.19,13.08 54.18,4.78 40.54,10.21 36.88,17.09 32.08,14.5
GND  (via drill 0.6, 0.9)
  Top 0.889: U1.TAB U1.4 49.28,64.26
  Top 1.016: 49.28,64.26 49.28,64.77 44.32,69.72
  Top 1.143: C15.- C16.- C17.- C18.- | C9.+ C13.+ C33.+ C35.+ | C9.+ C1.+ | C35.+ C9.+ | C32.+ C1.+ | C32.+ C34.+ | C1.+ C5.+ | C5.+ 54.1,75.44 | C35.+ C32.+ | C34.+ 58.17,75.86 R3.1 | C34.+ C5.+
  Top 1.27: C7.2 44.11,69.51 44.35,69.75 | 54.1,75.44 53.51,74.84 R1.1 49.62,74.84 49.02,75.44 47.16,75.44 C18.- 46.91,72.31 44.35,69.75 | v68.83,73.41 59.69,73.41 58.59,74.51 R3.1 | 44.35,69.75 44.32,69.72 | U$2.GND24 J2.P$1 | v82.68,35.66 86.69,35.66 91.5,40.47 U$11.P$60
  Bottom 0.203: U$11.P$70 105.95,39.33 110.41,43.79 114.78,43.79 U$2.GND26 | U$12.P$60 U$12.P$63 U$12.P$68 U$12.P$71 U$12.P$70 U$12.P$69 U$12.P$62 U$12.P$61 U$12.P$60
  Bottom 1.27: v68.83,73.41 69.6,73.41 77.56,65.44 C3.2 78.57,60.2 82.3,60.2 82.72,59.77 C31.- C30.- C29.- C14.- 82.68,35.97 v82.68,35.66
  pour Bottom: 41.5,117.27 71.12,117.27 71.12,124.61 41.5,124.61
  pour Bottom: 128.12,68.76 113.32,43.12 119.21,39.71 134.02,65.36
  pour Bottom: 74.3,112.78 74.3,101.75 78.92,101.78 78.94,112.78
  pour Bottom: 67.79,117.29 75.66,109.42 78.94,112.74 71.11,120.61
  pour Top: 23.89,42.43 9.08,68.08 3.19,64.68 17.99,39.03
  pour Top: 15.7,43.2 35.25,54.48 32.91,58.47 13.36,47.25
  pour Bottom: 121.57,43.62 114.67,47.6 112.36,43.56 119.23,39.57
  pour Bottom (isolate 0.305): 114.71,47.56 108.54,45.31 109.83,41.81 115.99,44.04
  pour Bottom: 107.93,37.65 111.4,43.67 108.64,45.25 105.16,39.25
  pour Bottom: 103.84,39.35 95.5,44.17 93.19,40.13 101.5,35.3
  pour Bottom (isolate 0.305): 106.99,40.42 100.45,38.04 101.48,35.28 108,37.64
  pour Top: 4.9,61.85 1.22,68.43 4.09,87.17 18.47,95.68 18.47,112.45 33.15,124.82 43.66,124.87 71.37,124.82 71.32,118.26 41.76,118.31 32.05,118.31 30.15,116.89 21.64,110.08 21.64,93.42 7.1,85.66 5.46,72.87 9.48,65.33
  pour Bottom: 132.87,63.22 136.14,68.68 132.94,87.6 118.69,95.99 118.69,112.47 113.39,116.87 74.35,116.87 74.3,112.55 113,112.6 115.14,111 115.21,94.08 130.18,85.04 132.11,73.86 128.8,66.22
  pour Top: 54.13,93.73 54.36,74.42 58.17,74.42 57.94,93.73
  pour Top: 44.45,95.76 44.45,73.28 46.86,73.28 46.86,95.76
  pour Top: 28.83,56.01 30.86,52.04 36.81,55.71 42.89,48.75 55.32,48.67 55.27,60.48 43.12,60.54 36.26,60.49
N$1
  Top 0.381: 53.39,62.94 U1.1
  Top 1.016: 53.59,62.74 53.39,62.94
  Top 1.143: 61.16,66.8 67.56,60.4 67.56,55.88 66.29,54.61 66.29,52.24 U$8.P$1
  Top 1.27: C6.2 61.16,66.8 U$1.P$4 57.1,62.74 56.7,62.74 56.67,62.76 55.6,62.76 55.57,62.74 53.59,62.74
N$2
  Bottom 1.016: U2.3 84.84,62.48 85.6,61.72
  Bottom 1.143: C20.1 99,61.72 85.6,61.72
N$3
  Top 0.889: C6.1 51.05,66.8 50.55,66.29 U1.3
N$4  (via drill 0.6)
  Top 0.889: U$10.P$2 89.53,88.14 86.11,91.57 v78.95,91.57
  Top 1.27: R6.2 90.83,88.07 U$10.P$2
  Bottom 1.143: C24.- v78.95,91.57 78.95,88.9 C25.- C26.-
  pour Bottom: 76.45,80.64 76.45,97.41 81.28,97.41 81.28,80.64
N$7
  Bottom 0.889: U2.1 91.36,64.31 | 91.36,64.31 | 91.36,64.31 | 91.36,64.31 98.11,64.31 C20.2 | 91.36,64.31 94.06,64.31 100.38,70.64 U$3.P$4 100.38,78.59
  Bottom 1.016: 100.38,78.59 102.36,80.57 102.36,87.54 U$9.P$1
N$8  (via drill 0.6)
  Top 1.143: C10.- C11.- C12.-
  Top 1.27: C12.- v72.05,53.51
  Bottom 1.27: v72.05,53.51 70.52,51.98 U$7.P$2 66.71,51.82 R7.2
  pour Top: 69.72,80.01 69.72,97.16 74.42,97.16 74.42,80.01
N$10
  Bottom 1.143: U$13.2 60.98,23.23 R4.2

### Text on the board
tPlace: Power Conversion Board v1.0 / Jan 2019 / Melchor De La Garza / Jason King / Ryan Pearson / Cynthia Zatlokowicz | +5V | +12V | 5V_GND | GND | 3.3V / GND | +3.3V